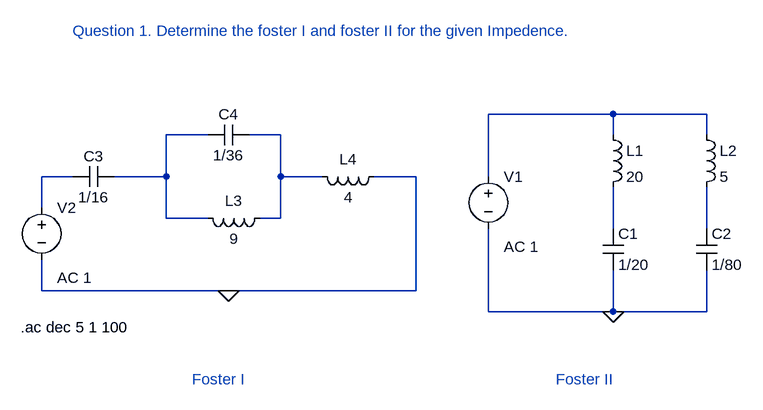
[diagram p0: schematic 1_Dheerendra_23EE019_Network_Synthesis.asc]
1_Dheerendra_23EE019_Network_Synthesis.asc, the LTspice schematic file:
Version 4
SHEET 1 880 680
WIRE 256 16 64 16
WIRE 400 16 256 16
WIRE -368 48 -432 48
WIRE -256 48 -304 48
WIRE 256 48 256 16
WIRE 400 48 400 16
WIRE -576 112 -624 112
WIRE -432 112 -432 48
WIRE -432 112 -512 112
WIRE -256 112 -256 48
WIRE -192 112 -256 112
WIRE -48 112 -112 112
WIRE 64 112 64 16
WIRE -624 160 -624 112
WIRE -432 176 -432 112
WIRE -368 176 -432 176
WIRE -256 176 -256 112
WIRE -256 176 -288 176
WIRE 256 192 256 128
WIRE 400 192 400 128
WIRE -624 288 -624 240
WIRE -336 288 -624 288
WIRE -48 288 -48 112
WIRE -48 288 -336 288
WIRE 64 320 64 192
WIRE 256 320 256 256
WIRE 256 320 64 320
WIRE 400 320 400 256
WIRE 400 320 256 320
FLAG 256 320 0
FLAG -336 288 0
SYMBOL voltage 64 96 R0
WINDOW 123 24 124 Left 2
WINDOW 39 0 0 Left 0
SYMATTR InstName V1
SYMATTR Value ""
SYMATTR Value2 AC 1
SYMBOL ind 240 32 R0
SYMATTR InstName L1
SYMATTR Value 20
SYMBOL ind 384 32 R0
SYMATTR InstName L2
SYMATTR Value 5
SYMBOL cap 240 192 R0
SYMATTR InstName C1
SYMATTR Value 1/20
SYMBOL cap 384 192 R0
SYMATTR InstName C2
SYMATTR Value 1/80
SYMBOL ind -96 96 R90
WINDOW 0 5 56 VBottom 2
WINDOW 3 32 56 VTop 2
SYMATTR InstName L4
SYMATTR Value 4
SYMBOL ind -272 160 R90
WINDOW 0 5 56 VBottom 2
WINDOW 3 32 56 VTop 2
SYMATTR InstName L3
SYMATTR Value 9
SYMBOL cap -304 32 R90
WINDOW 0 0 32 VBottom 2
WINDOW 3 32 32 VTop 2
SYMATTR InstName C4
SYMATTR Value 1/36
SYMBOL cap -512 96 R90
WINDOW 0 0 32 VBottom 2
WINDOW 3 32 32 VTop 2
SYMATTR InstName C3
SYMATTR Value 1/16
SYMBOL voltage -624 144 R0
WINDOW 123 24 124 Left 2
WINDOW 39 0 0 Left 0
SYMATTR InstName V2
SYMATTR Value ""
SYMATTR Value2 AC 1
TEXT -576 -112 Left 2 ;Question 1. Determine the foster I and foster II for the given Impedence.
TEXT -656 344 Left 2 !.ac dec 5 1 100
TEXT -392 424 Left 2 ;Foster I
TEXT 168 424 Left 2 ;Foster II

The netlist it stands for:
* 1_Dheerendra_23EE019_Network_Synthesis.asc
V1 N001 0 AC 1
L1 N001 N005 20
L2 N001 N006 5
C1 N005 0 1/20
C2 N006 0 1/80
L4 0 N003 4
L3 N003 N002 9
C4 N003 N002 1/36
C3 N002 N004 1/16
V2 N004 0 AC 1
* Question 1. Determine the foster I and foster II for the given Impedence.
.ac dec 5 1 100
* Foster I
* Foster II
.backanno
.end